# EAGLE design track-hold-lvc-sampler (EAGLE 9.4.2)
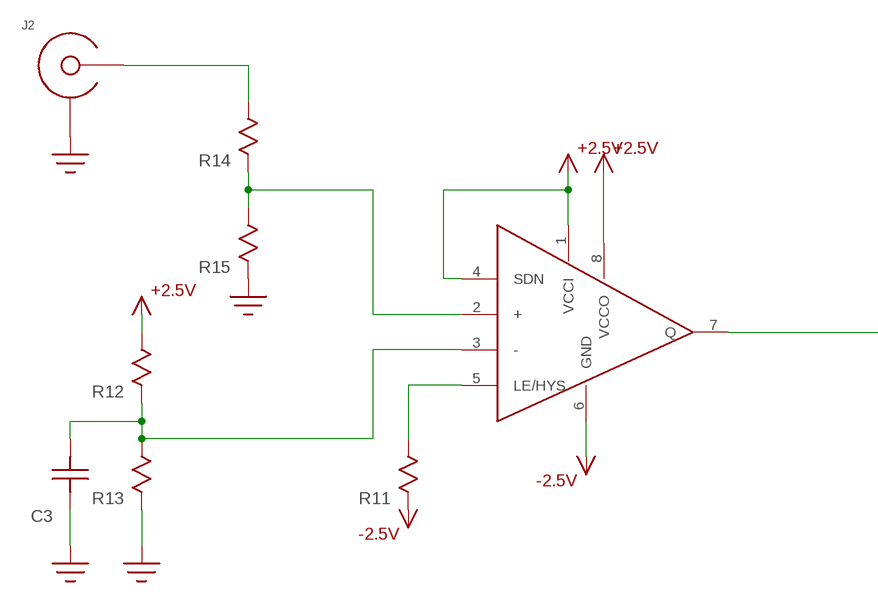
[diagram p0: schematic, sheet 1, part 1 of 2]
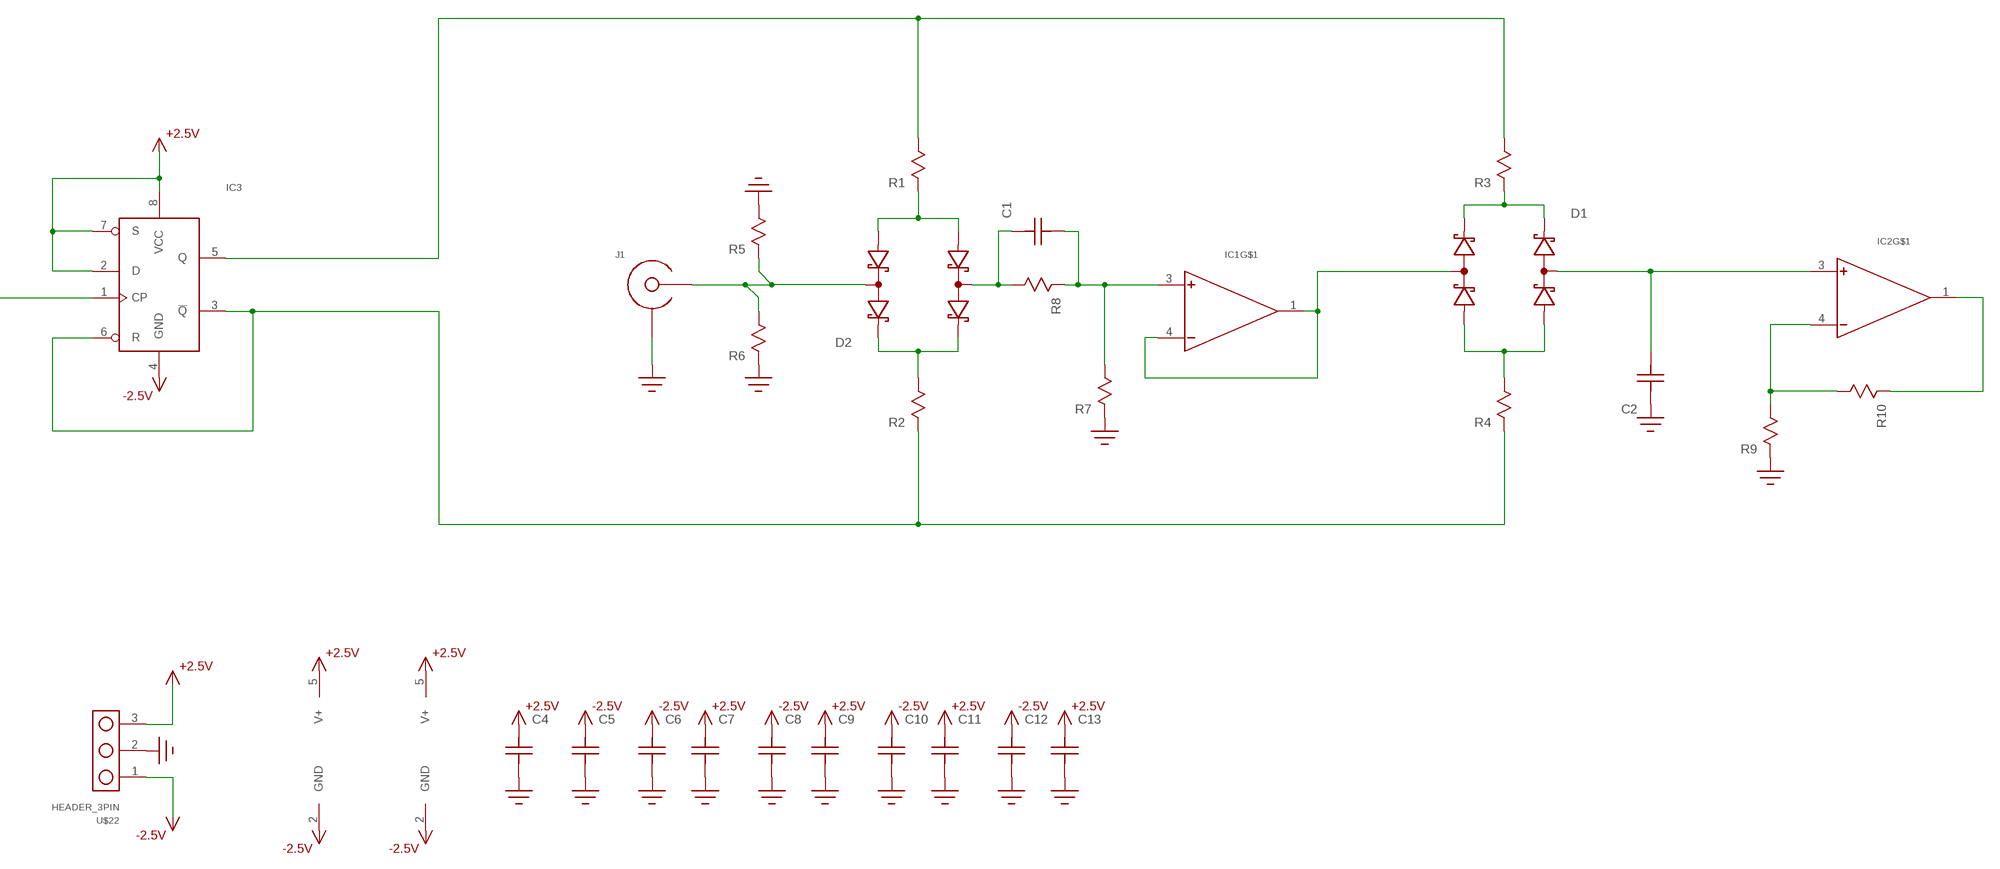
[diagram p1: schematic, sheet 1, part 2 of 2]

## Parts
C1  C0603  [C0603]
C2  C0603  [C0603]
C3  C0603  [C0603]
C4  C1206  [1206]
C5  C1206  [1206]
C6  C0603  [C0603]
C7  C0603  [C0603]
C8  C0603  [C0603]
C9  C0603  [C0603]
C10  C0603  [C0603]
C11  C0603  [C0603]
C12  C0603  [C0603]
C13  C0603  [C0603]
D1  SMS3923-081  [SC-88]
D2  SMS3923-081  [SC-88]
IC1  ADA4000TSOT  [TSOT-23]
IC2  ADA4000TSOT  [TSOT-23]
IC3  74LVC2G74  [SSOP8]
IC4  ADCMP602  [MSOP8]
J1  SMA-EDGE-LAUNCH4L-4020-TAPER-FIXED  [SMA_EDGE_LAUNCH_4L_4020_TAPER_FIXED]
J2  SMA-EDGE-LAUNCH4L-4020-TAPER-FIXED  [SMA_EDGE_LAUNCH_4L_4020_TAPER_FIXED]
R1  R0603  [R0603]
R2  R0603  [R0603]
R3  R0603  [R0603]
R4  R0603  [R0603]
R5  R0402  [0402]
R6  R0402  [0402]
R7  R0603  [R0603]
R8  R0603  [R0603]
R9  R0603  [R0603]
R10  R0603  [R0603]
R11  R0603  [R0603]
R12  R0603  [R0603]
R13  R0603  [R0603]
R14  R0603  [R0603]
R15  R0603  [R0603]
U$22  HEADER_3PIN  [HEADER_3PIN]

## Nets
+2.5V: C4.P$2 C7.P$2 C9.P$2 C11.P$2 C13.P$2 IC1.5(V+) IC2.5(V+) IC3.2(D) IC3.7(S) IC3.8(VCC) IC4.1(VCCI) IC4.4(SDN) IC4.8(VCCO) R12.P$2 U$22.3
-2.5V: C5.P$2 C6.P$2 C8.P$2 C10.P$2 C12.P$2 IC1.2(GND) IC2.2(GND) IC3.4(GND) IC4.6(GND) R11.P$1 U$22.1
GND: C2.P$2 C3.P$2 C4.P$1 C5.P$1 C6.P$1 C7.P$1 C8.P$1 C9.P$1 C10.P$1 C11.P$1 C12.P$1 C13.P$1 J1.BOTTOM_GND(SHIELD) J1.GND@1(SHIELD) J1.GND@2(SHIELD) J1.GND@3(SHIELD) J1.GND@4(SHIELD) J1.GND@5(SHIELD) J1.GND@6(SHIELD) J1.GND@7(SHIELD) J1.GND@8(SHIELD) J1.GND@14(SHIELD) J1.GND@15(SHIELD) J1.GND@16(SHIELD) J1.GND@17(SHIELD) J1.GND_PAD1(SHIELD) J1.GND_PAD2(SHIELD) J1.P$1(SHIELD) J1.P$2(SHIELD) J2.BOTTOM_GND(SHIELD) J2.GND@1(SHIELD) J2.GND@2(SHIELD) J2.GND@3(SHIELD) J2.GND@4(SHIELD) J2.GND@5(SHIELD) J2.GND@6(SHIELD) J2.GND@7(SHIELD) J2.GND@8(SHIELD) J2.GND@14(SHIELD) J2.GND@15(SHIELD) J2.GND@16(SHIELD) J2.GND@17(SHIELD) J2.GND_PAD1(SHIELD) J2.GND_PAD2(SHIELD) J2.P$1(SHIELD) J2.P$2(SHIELD) R5.2 R6.1 R7.P$1 R9.P$1 R13.P$1 R15.P$1 U$22.2
N$1: D2.2(COMMON0) J1.CENTER@1(CENTER) J1.P$3(CENTER) R5.1 R6.2
N$2: D2.1(ANODE0) D2.6(ANODE1) R1.P$1
N$3: D2.3(CATHODE0) D2.4(CATHODE1) R2.P$2
N$4: D1.3(CATHODE0) D1.4(CATHODE1) R3.P$1
N$5: D1.1(ANODE0) D1.6(ANODE1) R4.P$2
N$6: D1.5(COMMON1) IC1.1(OUT) IC1.4(-)
N$7: C1.P$2 D2.5(COMMON1) R8.P$2
N$8: C1.P$1 IC1.3(+) R7.P$2 R8.P$1
N$9: IC3.3(!Q!) IC3.6(R) R2.P$1 R4.P$1
N$10: IC3.1(CP) IC4.7(Q)
N$11: C2.P$1 D1.2(COMMON0) IC2.3(+)
N$12: IC2.4(-) R9.P$2 R10.P$2
N$13: IC2.1(OUT) R10.P$1
N$14: IC4.5(LE/HYS) R11.P$2
N$15: IC3.5(Q) R1.P$2 R3.P$2
N$16: C3.P$1 IC4.3(-) R12.P$1 R13.P$2
N$17: J2.CENTER@1(CENTER) J2.P$3(CENTER) R14.P$2
N$18: IC4.2(+) R14.P$1 R15.P$2

## Library data of the parts
C1-C13 = yapo:C
D1 D2 = yapo:SMS3923-081
IC1 IC2 = yapo:ADA4000
IC3 = yapo:74LVC2G74
IC4 = yapo:ADCMP602
J1 J2 = yapo:SMA-EDGE-LAUNCH
R1-R15 = yapo:R
U$22 = yapo:HEADER_3PIN

## Board
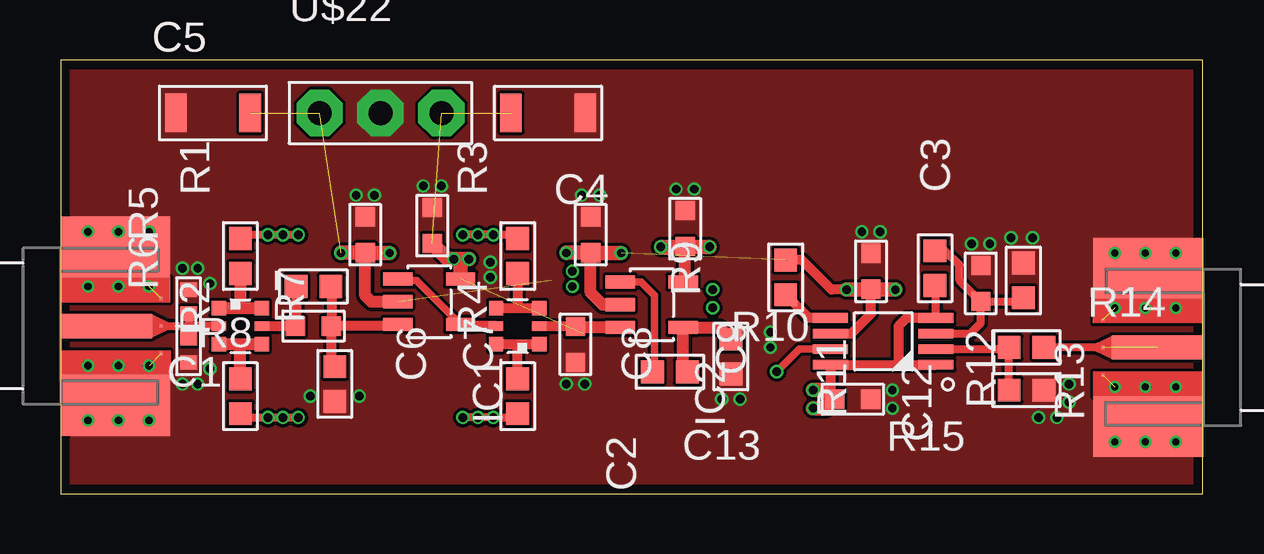
[diagram p2: board, top side]
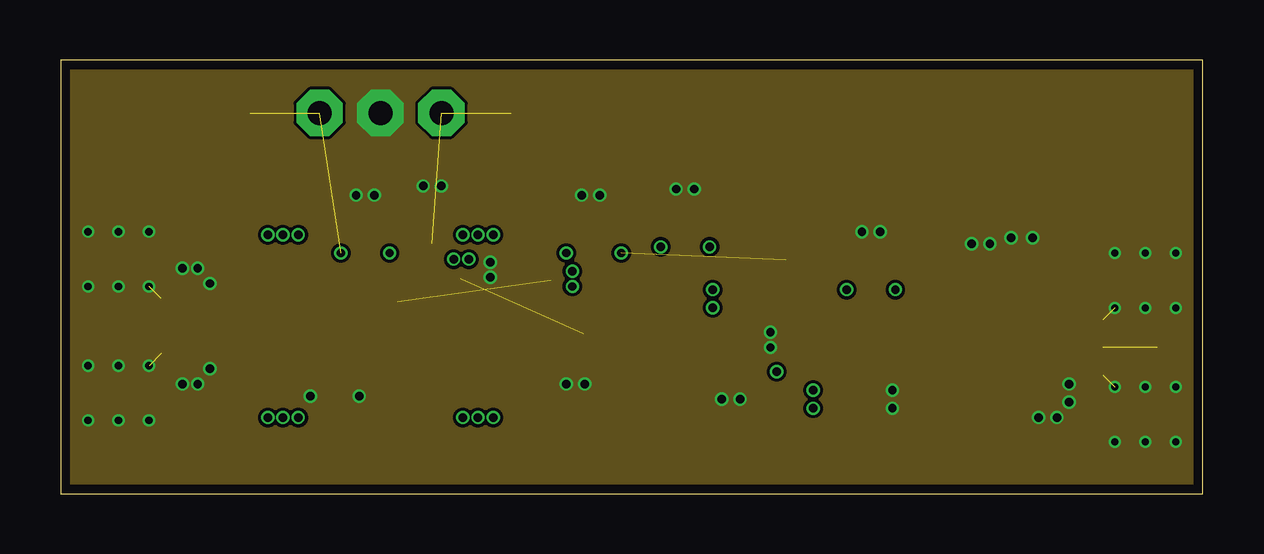
[diagram p3: board, inner layer Route2]
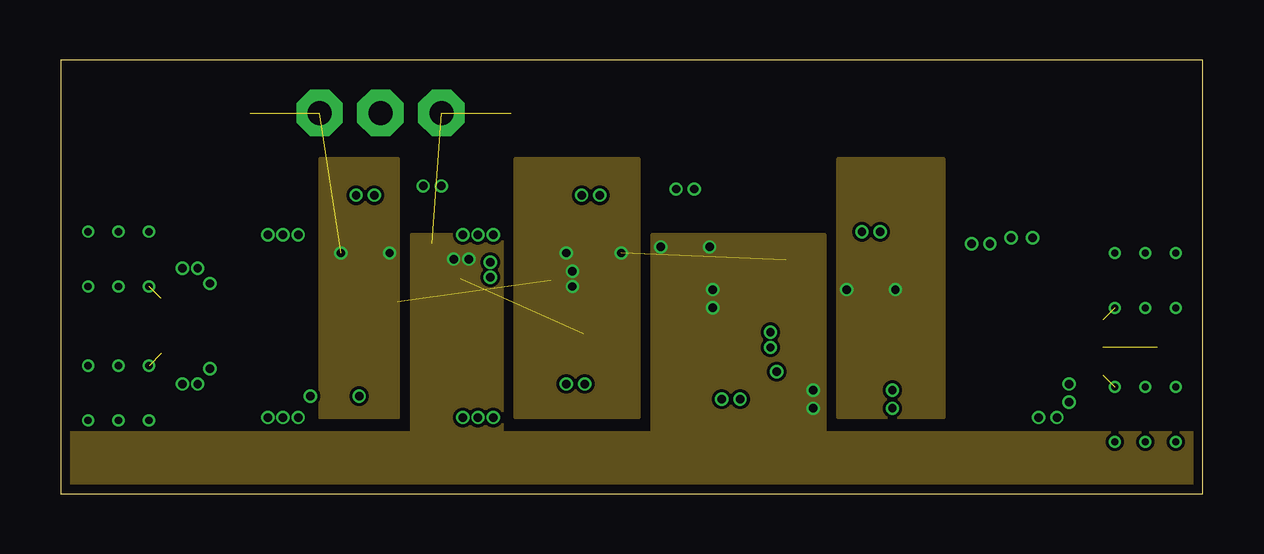
[diagram p4: board, inner layer Route15]
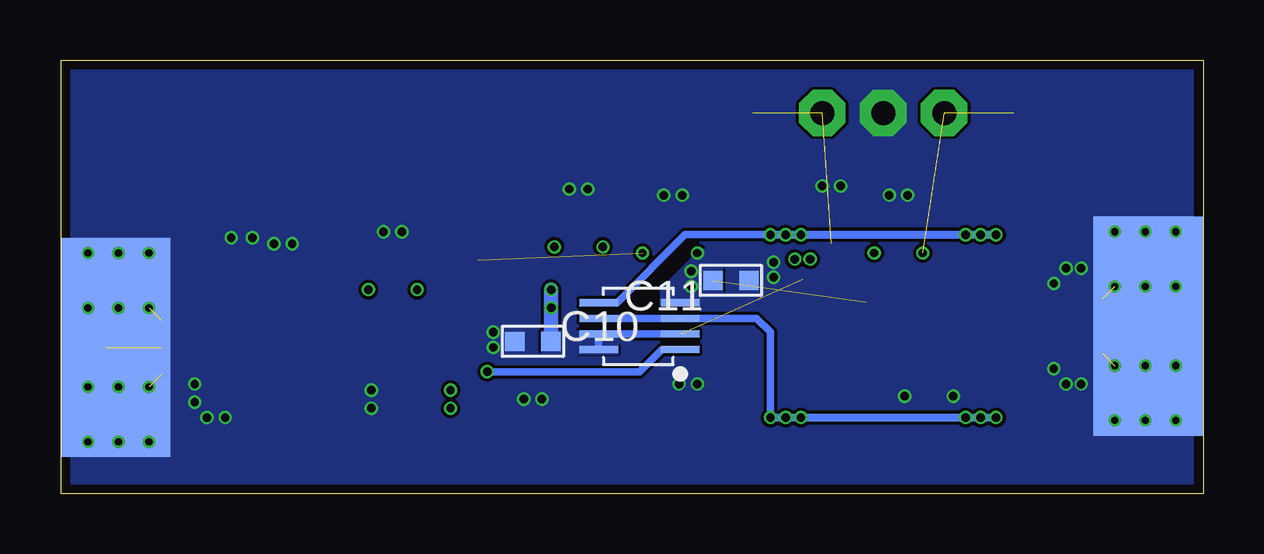
[diagram p5: board, bottom side, seen from below]

Size 47.6 x 18.09 mm. Coordinates in mm from the lower left corner, seen from the top.
Outline: 0,0 47.6,0 47.6,18.09 0,18.09 0,0
Copper layers (1*2*15*16): Top 0.035559375mm / dielectric 0.17018125mm / Route2 0.01778125mm / dielectric 47mil / Route15 0.01778125mm / dielectric 0.17018125mm / Bottom 0.035559375mm
Design rules "oshpark-4layer": minimum track width 5mil, minimum drill 10mil, track to track 5mil, track to pad 5mil, pad to pad 5mil, via to via 5mil, smd to smd 5mil, copper to edge 15mil, drill to drill 6mil, minimum pad ring 4mil, minimum via ring 4mil, stop-mask expansion 2.5mil, vias tented up to drill 0mil, thermal gap 10mil

### Footprints (pad centres in the part's own frame; a part is rotated, then mirrored left to right if it is on the bottom)
C0603 = smd 0.8 x 0.8: P$1 -0.75,0; P$2 0.75,0
1206 = smd 0.9 x 1.6: P$1 -1.55,0; P$2 1.55,0
SC-88 = smd 0.6 x 0.6: 1 -0.9,0.75; 3 -0.9,-0.75; 4 0.9,-0.75; 6 0.9,0.75 | smd 0.6 x 0.4: 2 -0.9,0; 5 0.9,0
TSOT-23 = smd 0.55 x 1.22: 1 -0.95,-1.31; 2 0,-1.31; 3 0.95,-1.31; 4 0.95,1.31; 5 -0.95,1.31
SSOP8 = smd 0.3 x 1.6: 1 -0.975,-1.7; 2 -0.325,-1.7; 3 0.325,-1.7; 4 0.975,-1.7; 5 0.975,1.7; 6 0.325,1.7; 7 -0.325,1.7; 8 -0.975,1.7
MSOP8 = smd 0.4 x 1.45: 1 -0.975,-2.2; 2 -0.325,-2.2; 3 0.325,-2.2; 4 0.975,-2.2; 5 0.975,2.2; 6 0.325,2.2; 7 -0.325,2.2; 8 -0.975,2.2
SMA_EDGE_LAUNCH_4L_4020_TAPER_FIXED = smd 4.572 x 9.144 bottom: BOTTOM_GND 2.286,0 | smd 3.81 x 1.016: CENTER@1 1.905,0 | drill 0.3: GND@1 1.143,3.937; GND@2 3.683,3.937; GND@3 1.143,1.651; GND@4 3.683,1.651; GND@5 1.143,-1.651; GND@6 3.683,-1.651; GND@7 1.143,-3.937; GND@8 3.683,-3.937; GND@14 2.413,3.937; GND@15 2.413,-3.937; GND@16 2.413,-1.651; GND@17 2.413,1.651 | smd 4.572 x 2.54: GND_PAD1 2.286,3.302; GND_PAD2 2.286,-3.302 | smd 0.127 x 0.127: P$1 4.191,1.143; P$2 4.191,-1.143; P$3 4.191,0
R0603 = smd 0.95 x 0.95: P$1 -0.725,0; P$2 0.725,0
0402 = smd 0.6 x 0.7: 1 -0.5,0; 2 0.5,0
HEADER_3PIN = drill 1 pad 1.93 octagon: 1 -2.54,0; 2 0,0; 3 2.54,0

### Placement (x,y rotation side)
C1  10.54,6.99 180 top
C2  21.46,6.22 270 top
C3  38.35,8.76 90 top
C4  20.32,15.88 180 top
C5  6.35,15.88 0 top
C6  12.7,10.79 270 top
C7  15.49,11.18 270 top
C8  22.1,10.79 270 top
C9  26.04,11.05 270 top
C10  19.68,8.89 180 bottom
C11  27.94,6.35 0 bottom
C12  33.78,9.27 270 top
C13  33.02,3.94 180 top
D1  19.05,6.99 180 top
D2  7.49,6.99 0 top
IC1  15.37,8 270 top
IC2  24.64,7.87 270 top
IC3  23.5,6.99 90 bottom
IC4  34.29,6.35 90 top
J1  0,6.99 0 top
J2  47.62,6.1 180 top
R1  7.49,9.91 90 top
R2  7.49,4.06 90 top
R3  19.05,9.91 90 top
R4  19.05,4.06 90 top
R5  5.33,8 90 top
R6  5.33,5.97 90 top
R7  11.43,4.57 90 top
R8  10.54,8.64 180 top
R9  27.94,5.71 90 top
R10  25.4,5.08 0 top
R11  30.23,9.02 270 top
R12  36.45,9.4 270 top
R13  40.13,8.89 270 top
R14  40.26,6.1 0 top
R15  40.26,4.32 180 top
U$22  13.34,15.88 0 top

### Tracks (layer width: path | path; a pad name or v marks a point on that pad's centre or on a via)
+2.5V  (via drill 0.35)  (3 unrouted)
  Top 0.343: IC4.4 36.49,8.63 R12.P$2
  Top 0.406: 34.92,5.38 IC4.8 32.09,4.12 C13.P$2 | 34.92,5.38 IC4.1 | IC4.4 35.27,7.33 34.92,6.99 34.92,5.38
  Top 0.508: IC2.5 26.04,8.91 C9.P$2
  Top 0.61: v25.02,10.29 26.02,10.29 C9.P$2 26.05,10.29 v27.05,10.29 | v31.37,4.32 31.89,4.32 C13.P$2 31.89,3.56 v31.37,3.56 | IC1.5 16.68,9.78 v17.02,9.78 v16.38,9.78 16.14,9.78 C7.P$2
  Bottom 0.305: IC3.2 IC3.7 IC3.8
  Bottom 0.61: C11.P$2 27.19,7.74 v27.18,7.75 v27.18,8.51
  pour Bottom (no thermals): 27.56,6.73 27.56,5.84 24.38,5.84 24.38,6.73
  pour Route15 (no thermals): 14.61,10.79 14.61,0.64 18.41,0.64 18.41,10.79
  pour Route15 (no thermals): 24.64,10.79 24.64,0.64 31.88,0.64 31.88,10.79
  pour Route15 (no thermals): 0,0 47.62,0 47.62,2.54 0,2.54
-2.5V  (via drill 0.35)  (4 unrouted)
  Top 0.406: IC4.6 32.96,6.67 33.78,7.49 C12.P$2 | v32.77,8.51 32.13,8.51 30.9,9.74 R11.P$1
  Top 0.508: IC1.2 12.95,8 12.7,8.26 C6.P$2 | IC2.2 22.61,7.87 22.1,8.38 C8.P$2
  Top 0.61: v11.68,10.03 11.7,10.04 C6.P$2 12.71,10.03 v13.72,10.03 | v21.08,10.03 21.09,10.04 C8.P$2 v23.37,10.03 | v32.77,8.51 C12.P$2 33.79,8.51 v34.8,8.51
  other vias: 21.34,9.27 21.34,8.64
  pour Bottom (no thermals): 22.61,7.87 20.07,7.87 20.07,10.16 20.95,10.16 22.61,8.51
  pour Route15 (no thermals): 10.79,13.97 10.79,3.17 14.1,3.17 14.1,13.97
  pour Route15 (no thermals): 18.92,13.97 18.92,3.17 24.13,3.17 24.13,13.97
  pour Route15 (no thermals): 32.38,13.97 32.38,3.17 36.83,3.17 36.83,13.97
GND  (via drill 0.35)  (4 unrouted)
  other vias: 5.08,9.4 5.71,9.4 5.08,4.57 5.71,4.57 10.41,4.06 12.45,4.06 12.32,12.45 13.08,12.45 15.11,12.83 15.88,12.83 21.72,12.45 22.48,12.45 25.65,12.7 26.42,12.7 27.56,3.94 28.32,3.94 21.08,4.57 21.84,4.57 17.91,9.65 17.91,9.02 29.59,6.73 29.59,6.1 34.67,4.32 34.67,3.56 33.4,10.92 34.16,10.92 6.22,8.76 6.22,5.21 40.77,3.17 41.53,3.17 42.04,4.57 42.04,3.81 39.62,10.67 40.51,10.67 37.97,10.41 38.73,10.41
  pour Bottom (no thermals): 19.3,8.51 17.53,8.51 17.53,10.16 19.3,10.16
  pour Bottom (no thermals): 28.32,6.99 28.32,5.71 29.84,5.71 29.84,6.99
  pour Top (no thermals): 0,0 47.62,0 47.62,17.78 0,17.78
  pour Bottom (no thermals): 0,0 47.62,0 47.62,17.78 0,17.78
  pour Route2 (no thermals): 0,0 47.62,0 47.62,17.78 0,17.78
N$1
  Top 0.343: D2.2 5.33,6.99 | R5.1 5.33,6.99 | R6.2 5.33,6.99 | 5.33,6.99 J1.P$3 J1.CENTER@1 3.81,6.99
N$2
  Top 0.508: D2.1 7.62,7.74 | 7.62,7.74 D2.6 | R1.P$1 7.49,7.86 7.62,7.74
N$3
  Top 0.508: D2.3 7.62,6.24 | 7.62,6.24 D2.4 | R2.P$2 7.49,6.11 7.62,6.24
N$4
  Top 0.406: D1.4 19.05,7.74 | 19.05,7.74 D1.3 | R3.P$1 19.05,7.74
N$5
  Top 0.406: D1.6 19.05,6.24 | 19.05,6.24 D1.1 | R4.P$2 19.05,6.24
N$6
  Top 0.305: IC1.1 14.12,8.89 14.84,8.89 IC1.4
  Top 0.406: D1.5 16.74,6.99 IC1.4
N$7
  Top 0.406: C1.P$2 9.82,6.96 | D2.5 C1.P$2 | R8.P$2 9.82,7.01 C1.P$2
N$8
  Top 0.406: 11.29,8.66 R8.P$1 11.29,8.61 C1.P$1 | 11.39,5.33 R7.P$2 11.29,5.44 C1.P$1 | IC1.3 13.99,6.99 C1.P$1
  Top 0.508: 11.33,8.7 R8.P$1
N$9  (via drill 0.35)
  Top 0.343: R2.P$1 7.66,3.17 v8.64,3.17 v9.27,3.17 v9.91,3.17 | R4.P$1 18.89,3.17 v18.03,3.17 v17.4,3.17 v16.76,3.17
  Bottom 0.305: IC3.6 IC3.3 18.61,7.31 18.03,6.73 v18.03,3.17
  Bottom 0.343: v18.03,3.17 v8.64,3.17
N$10  (via drill 0.35)
  Top 0.305: v29.84,5.08 30.79,6.03 IC4.7
  Bottom 0.305: IC3.1 22.57,6.01 23.5,5.08 v29.84,5.08
N$11
  Top 0.406: D1.2 21.45,6.99 C2.P$1
  Top 0.508: IC2.3 21.51,6.92 21.45,6.99
N$12
  Top 0.508: R9.P$2 27.46,6.92 IC2.4 25.95,5.26 R10.P$2
N$13
  Top 0.305: IC2.1 24.2,8.82 24.77,8.26 24.77,5.17 R10.P$1
N$14
  Top 0.406: IC4.5 31.19,7.33 R11.P$2
N$15  (via drill 0.35)
  Top 0.343: R1.P$2 7.66,10.79 v8.64,10.79 v9.27,10.79 v9.91,10.79 | R3.P$2 18.89,10.79 v18.03,10.79 v17.4,10.79 v16.76,10.79
  Bottom 0.305: IC3.5 24.43,7.96 21.59,10.79 v18.03,10.79
  Bottom 0.343: v18.03,10.79 v8.64,10.79
N$16
  Top 0.343: IC4.3 37.92,6.67 38.35,7.11 C3.P$1 | C3.P$1 39.98,8.01 R13.P$2 | C3.P$1 37.47,8.89 37.47,9.53 36.87,10.12 R12.P$1
N$17  (1 unrouted)
  Top 0.343: J2.CENTER@1 R14.P$2
N$18
  Top 0.343: IC4.2 39.46,6.03 R14.P$1 R15.P$2